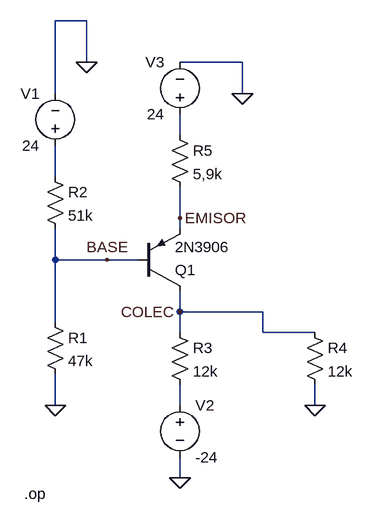
[diagram p0: schematic 1809practica.asc]
1809practica.asc, the LTspice schematic file:
Version 4
SHEET 1 880 680
WIRE -32 -240 -80 -240
WIRE -32 -176 -32 -240
WIRE 208 -176 112 -176
WIRE -80 -128 -80 -240
WIRE 208 -128 208 -176
WIRE 112 -64 112 -96
WIRE -80 0 -80 -48
WIRE 112 64 112 16
WIRE 112 80 112 64
WIRE -80 128 -80 80
WIRE 0 128 -80 128
WIRE 48 128 0 128
WIRE 112 208 112 176
WIRE 240 208 112 208
WIRE -80 224 -80 128
WIRE 112 240 112 208
WIRE 240 240 240 208
WIRE 320 240 240 240
WIRE -80 352 -80 304
WIRE 112 352 112 320
WIRE 320 352 320 320
WIRE 112 464 112 432
FLAG -32 -176 0
FLAG -80 352 0
FLAG 112 464 0
FLAG 320 352 0
FLAG 208 -128 0
FLAG 0 128 BASE
FLAG 112 64 EMISOR
FLAG 112 208 COLEC
SYMBOL res -96 208 R0
SYMATTR InstName R1
SYMATTR Value 47k
SYMBOL res -96 -16 R0
SYMATTR InstName R2
SYMATTR Value 51k
SYMBOL res 96 224 R0
SYMATTR InstName R3
SYMATTR Value 12k
SYMBOL res 304 224 R0
SYMATTR InstName R4
SYMATTR Value 12k
SYMBOL res 96 -80 R0
SYMATTR InstName R5
SYMATTR Value 5,9k
SYMBOL voltage -80 -32 R180
WINDOW 0 24 96 Left 2
WINDOW 3 24 16 Left 2
WINDOW 123 0 0 Left 0
WINDOW 39 0 0 Left 0
SYMATTR InstName V1
SYMATTR Value 24
SYMBOL voltage 112 336 R0
WINDOW 123 0 0 Left 0
WINDOW 39 0 0 Left 0
SYMATTR InstName V2
SYMATTR Value -24
SYMBOL voltage 112 -80 R180
WINDOW 0 24 96 Left 2
WINDOW 3 24 16 Left 2
WINDOW 123 0 0 Left 0
WINDOW 39 0 0 Left 0
SYMATTR InstName V3
SYMATTR Value 24
SYMBOL pnp 48 176 M180
SYMATTR InstName Q1
SYMATTR Value 2N3906
TEXT -128 488 Left 2 !.op

The netlist it stands for:
* 1809practica.asc
R1 BASE 0 47k
R2 N002 BASE 51k
R3 COLEC N003 12k
R4 COLEC 0 12k
R5 N001 EMISOR 5,9k
V1 N002 0 24
V2 N003 0 -24
V3 N001 0 24
Q1 COLEC BASE EMISOR 0 2N3906
.model NPN NPN
.model PNP PNP
.lib standard.bjt
.op
.backanno
.end